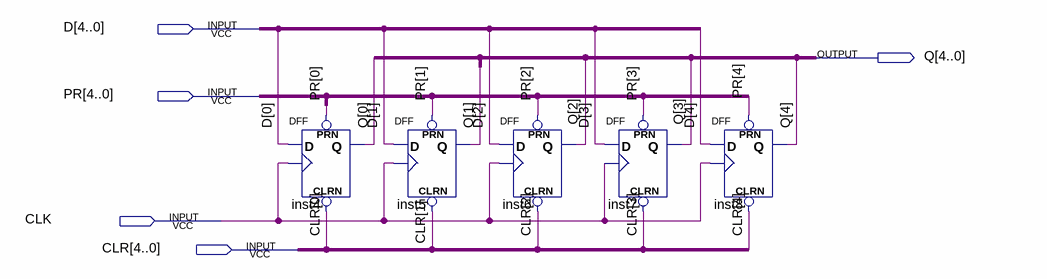
[diagram p0: schematic sheet]
// Quartus schematic 5_bit_register.bdf as structural Verilog: 5 symbols, 5 pins
module \5_bit_register  (
  input  [4:0] D,
  input  [4:0] PR,
  input  CLK,
  input  [4:0] CLR,
  output [4:0] Q
);

  DFF inst4 (.CLRN(CLR[0]), .CLK(CLK), .D(D[0]), .PRN(PR[0]), .Q(Q[0]));
  DFF inst5 (.CLRN(CLR[1]), .CLK(CLK), .D(D[1]), .PRN(PR[1]), .Q(Q[1]));
  DFF inst6 (.CLRN(CLR[2]), .CLK(CLK), .D(D[2]), .PRN(PR[2]), .Q(Q[2]));
  DFF inst7 (.CLRN(CLR[3]), .CLK(CLK), .D(D[3]), .PRN(PR[3]), .Q(Q[3]));
  DFF inst8 (.CLRN(CLR[4]), .CLK(CLK), .D(D[4]), .PRN(PR[4]), .Q(Q[4]));
endmodule
